# Altium schematic sheet lowpass-filters.SchDoc
size A3; SheetNumber: 1; SheetTotal: 6
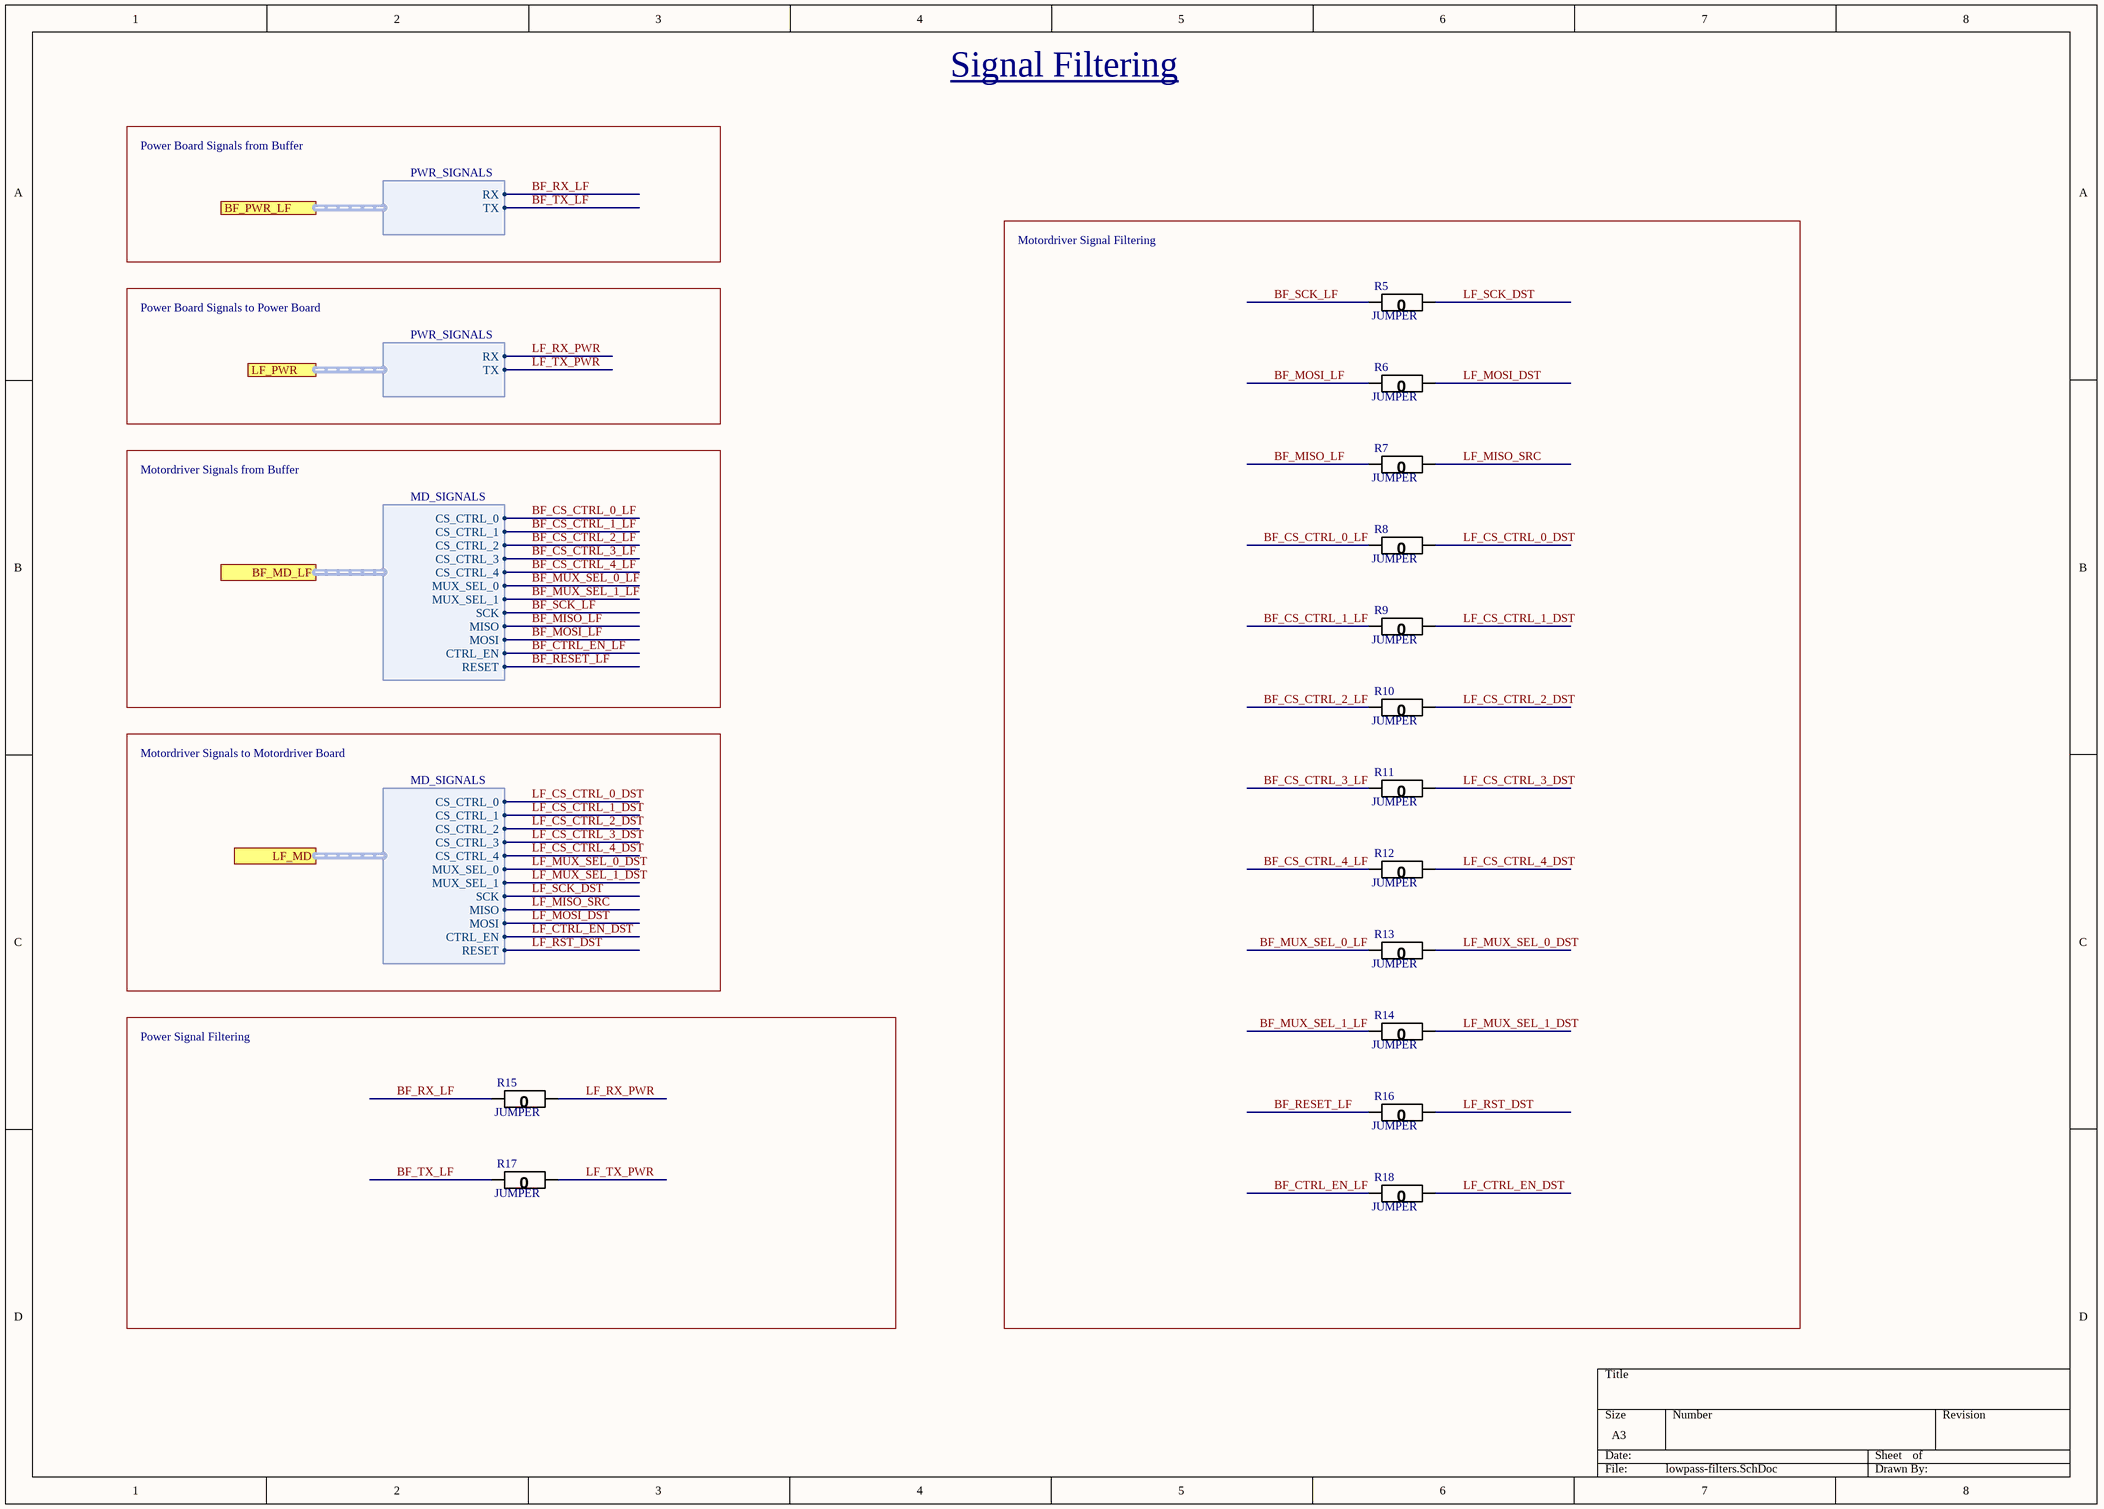
[diagram p0: lowpass-filters.SchDoc]

## Parts
R5  JUMPER  [0603]
R6  JUMPER  [0603]
R7  JUMPER  [0603]
R8  JUMPER  [0603]
R9  JUMPER  [0603]
R10  JUMPER  [0603]
R11  JUMPER  [0603]
R12  JUMPER  [0603]
R13  JUMPER  [0603]
R14  JUMPER  [0603]
R15  JUMPER  [0603]
R16  JUMPER  [0603]
R17  JUMPER  [0603]
R18  JUMPER  [0603]

## Blocks framed on the sheet
Motordriver Signal Filtering: R5-R14 R16 R18
Power Signal Filtering: R15 R17

## Ports
BF_MD_LF (harness MD_SIGNALS), BF_PWR_LF (harness PWR_SIGNALS), LF_MD (harness MD_SIGNALS), LF_PWR (harness PWR_SIGNALS)

## Harnesses
PWR_SIGNALS: TX, RX
MD_SIGNALS: CS_CTRL_0, MUX_SEL_1, SCK, MOSI, MISO, CS_CTRL_1, CS_CTRL_2, CS_CTRL_3, CS_CTRL_4, MUX_SEL_0, CTRL_EN, RESET

## Nets
BF_CS_CTRL_0_LF: R8.2(R2) ; port BF_MD_LF.CS_CTRL_0
BF_CS_CTRL_1_LF: R9.2(R2) ; port BF_MD_LF.CS_CTRL_1
BF_CS_CTRL_2_LF: R10.2(R2) ; port BF_MD_LF.CS_CTRL_2
BF_CS_CTRL_3_LF: R11.2(R2) ; port BF_MD_LF.CS_CTRL_3
BF_CS_CTRL_4_LF: R12.2(R2) ; port BF_MD_LF.CS_CTRL_4
BF_CTRL_EN_LF: R18.2(R2) ; port BF_MD_LF.CTRL_EN
BF_MISO_LF: R7.2(R2) ; port BF_MD_LF.MISO
BF_MOSI_LF: R6.2(R2) ; port BF_MD_LF.MOSI
BF_MUX_SEL_0_LF: R13.2(R2) ; port BF_MD_LF.MUX_SEL_0
BF_MUX_SEL_1_LF: R14.2(R2) ; port BF_MD_LF.MUX_SEL_1
BF_RESET_LF: R16.2(R2) ; port BF_MD_LF.RESET
BF_RX_LF: R15.2(R2) ; port BF_PWR_LF.RX
BF_SCK_LF: R5.2(R2) ; port BF_MD_LF.SCK
BF_TX_LF: R17.2(R2) ; port BF_PWR_LF.TX
LF_CS_CTRL_0_DST: R8.1(R1) ; port LF_MD.CS_CTRL_0
LF_CS_CTRL_1_DST: R9.1(R1) ; port LF_MD.CS_CTRL_1
LF_CS_CTRL_2_DST: R10.1(R1) ; port LF_MD.CS_CTRL_2
LF_CS_CTRL_3_DST: R11.1(R1) ; port LF_MD.CS_CTRL_3
LF_CS_CTRL_4_DST: R12.1(R1) ; port LF_MD.CS_CTRL_4
LF_CTRL_EN_DST: R18.1(R1) ; port LF_MD.CTRL_EN
LF_MISO_SRC: R7.1(R1) ; port LF_MD.MISO
LF_MOSI_DST: R6.1(R1) ; port LF_MD.MOSI
LF_MUX_SEL_0_DST: R13.1(R1) ; port LF_MD.MUX_SEL_0
LF_MUX_SEL_1_DST: R14.1(R1) ; port LF_MD.MUX_SEL_1
LF_RST_DST: R16.1(R1) ; port LF_MD.RESET
LF_RX_PWR: R15.1(R1) ; port LF_PWR.RX
LF_SCK_DST: R5.1(R1) ; port LF_MD.SCK
LF_TX_PWR: R17.1(R1) ; port LF_PWR.TX

## Notes on the sheet
- Signal Filtering
- Power Board Signals from Buffer
- Power Board Signals to Power Board
- Motordriver Signals from Buffer
- Motordriver Signals to Motordriver Board

## Library data of the parts
R5-R18 = RES 0 JUMPER: RES SMD 0 OHM JUMPER GENERIC 0603; Manufacturer Part Number 1: RK73Z1JTTD; Value: 0; Package: 0805; Part Number: RES 0 JUMPER; Tolerance: N/A; Supplier 1: Digi-Key; Supplier Part Number 1: 2019-RK73Z1JTTDCT-ND; Supplier URL 1: https://www.digikey.ca/en/products/detail/koa-speer-electronics-inc/RK73Z1JTTD/9845478